# Altium schematic sheet ACS758.SchDoc
size A4; SheetNumber: 7; SheetTotal: 8
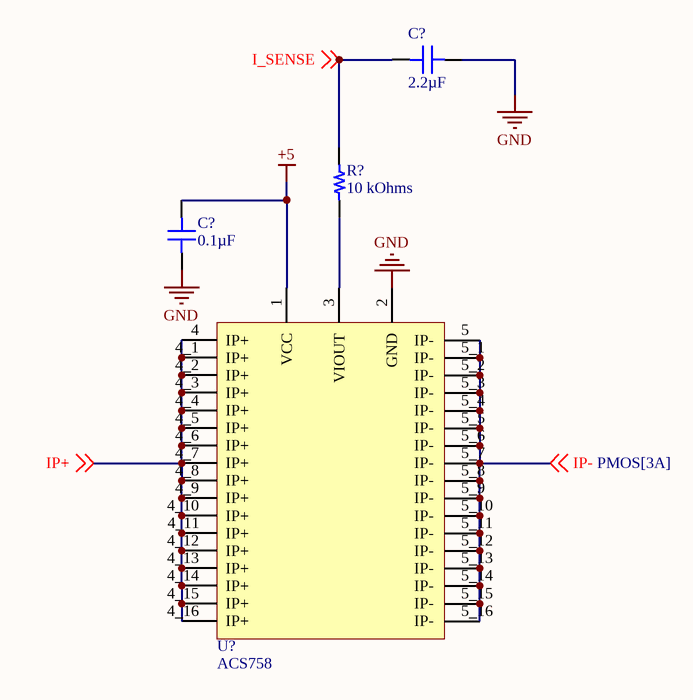
[diagram p0: ACS758.SchDoc]

## Parts
(Parts that share a designator on the sheet are numbered #1, #2 ... from top to bottom, then left to right.)
C?#1  2.2µF  [CAP 0603_1608]
C?#2  0.1µF  [CAP 0603_1608]
R?  10 kOhms  [RES 0603_1608]
U?  ACS758

## Nets
+5: C?#2.2 U?.1(VCC)
GND: C?#1.2 C?#2.1 U?.2(GND)
I_SENSE: C?#1.1 R?.2 ; off-sheet I_SENSE
IP+: U?.4(IP+) U?.4_1(IP+) U?.4_2(IP+) U?.4_3(IP+) U?.4_4(IP+) U?.4_5(IP+) U?.4_6(IP+) U?.4_7(IP+) U?.4_8(IP+) U?.4_9(IP+) U?.4_10(IP+) U?.4_11(IP+) U?.4_12(IP+) U?.4_13(IP+) U?.4_14(IP+) U?.4_15(IP+) U?.4_16(IP+) ; off-sheet IP+
IP-: U?.5(IP-) U?.5_1(IP-) U?.5_2(IP-) U?.5_3(IP-) U?.5_4(IP-) U?.5_5(IP-) U?.5_6(IP-) U?.5_7(IP-) U?.5_8(IP-) U?.5_9(IP-) U?.5_10(IP-) U?.5_11(IP-) U?.5_12(IP-) U?.5_13(IP-) U?.5_14(IP-) U?.5_15(IP-) U?.5_16(IP-) ; off-sheet IP-
NetR?_1: R?.1 U?.3(VIOUT)

## Library data of the parts
C?#1 = 0603YD225KAT4A: CAP CER 2.2UF 16V X5R 0603; manufacturer: AVX Corporation; Tolerance: ±10%; Part Number: 0603YD225KAT4A; Capacitance: 2.2µF; Applications: General Purpose; componentlink1description: Datasheet; componentlink1url: http://datasheets.avx.com/cx5r.pdf; componentlink2description: DigiKey Link; componentlink2url: http://digikey.com/product-detail/en/avx-corporation/0603YD225KAT4A/478-12464-1-ND/9749316; Device Package: 0603 (1608 Metric); lastupdated: 2.09.2020 01:03:21; Lifecycle Status: Active; Minimum Order: 1; Mounting Type: Surface Mount, MLCC; Operating Temperature: -55°C ~ 85°C; Package / Case: 0603 (1608 Metric); packaging: TapeAndReel; partid: 10384; Part Status: Active; price: 0.19; series: -; Size / Dimension: 0.063" L x 0.032" W (1.60mm x 0.81mm); Supplier 1: DigiKey; Supplier Part Number 1: 478-12464-1-ND; Temperature Coefficient: X5R; Thickness (Max): 0.037" (0.94mm); value: 2.2µF; Voltage - Rated: 16V; JLCBPCB Part Number: C1607
C?#2 = 06035G104ZAT2A: CAP CER 0.1UF 50V Y5V 0603; manufacturer: AVX Corporation; Temperature Coefficient: Y5V (F); Tolerance: -20%, +80%; Part Number: 06035G104ZAT2A; Capacitance: 0.1µF; Applications: General Purpose; componentlink1description: Datasheet; componentlink1url: http://datasheets.avx.com/Y5V.pdf; componentlink2description: DigiKey Link; componentlink2url: http://digikey.com/product-detail/en/avx-corporation/06035G104ZAT2A/478-3724-1-ND/1116422; Device Package: 0603 (1608 Metric); lastupdated: 2.09.2020 01:03:30; Lifecycle Status: Active; Minimum Order: 1; Mounting Type: Surface Mount, MLCC; Operating Temperature: -30°C ~ 85°C; Package / Case: 0603 (1608 Metric); packaging: TapeAndReel; partid: 5562; Part Status: Active; price: 0.01; series: -; Size / Dimension: 0.063" L x 0.032" W (1.60mm x 0.81mm); Supplier 1: DigiKey; Supplier Part Number 1: 478-3724-1-ND; Thickness (Max): 0.035" (0.90mm); value: 0.1µF; Voltage - Rated: 50V; JLCPCB Part Number: C1590
R? = CPF0603B10KE: RES SMD 10K OHM 0.1% 1/16W 0603; Manufacturer: TE Connectivity Passive Product; Power (Watts): 0.063W, 1/16W; Temperature Coefficient: ±25ppm/°C; Part Number: CPF0603B10KE; Value: 10 kOhms; ComponentLink1Description: Datasheet; ComponentLink1URL: https://www.te.com/commerce/DocumentDelivery/DDEController?Action=srchrtrv&DocNm=1773200&DocType=DS&DocLang=English; ComponentLink2Description: DigiKey Link; ComponentLink2URL: https://www.digikey.com/en/products/detail/te-connectivity-passive-product/CPF0603B10KE/2389826; Composition: Thin Film; Device Package: 0603 (1608 Metric); Height - Seated (Max): 0.022" (0.55mm); LastUpdated: 9.02.2024 20:43:37; Lifecycle Status: Active; Minimum Order: 1; Number of Terminations: 2; Operating Temperature: -55°C ~ 155°C; Package / Case: 0603 (1608 Metric); Packaging: TapeAndReel; PartId: 4872; Part Status: Active; Price: 0.09; Resistance: 10 kOhms; Series: CPF, Neohm; Size / Dimension: 0.061" L x 0.031" W (1.55mm x 0.80mm); Supplier 1: DigiKey; Supplier Part Number 1: A119886CT-ND; Supplier Device Package: 0603; Tolerance: ±0.1%; JLCPCB Part Number: C15401
U? = ACS758: Current Sensor 150A 1 Channel Hall Effect, Open Loop Unidirectional 5-CB Formed Leads, PFF